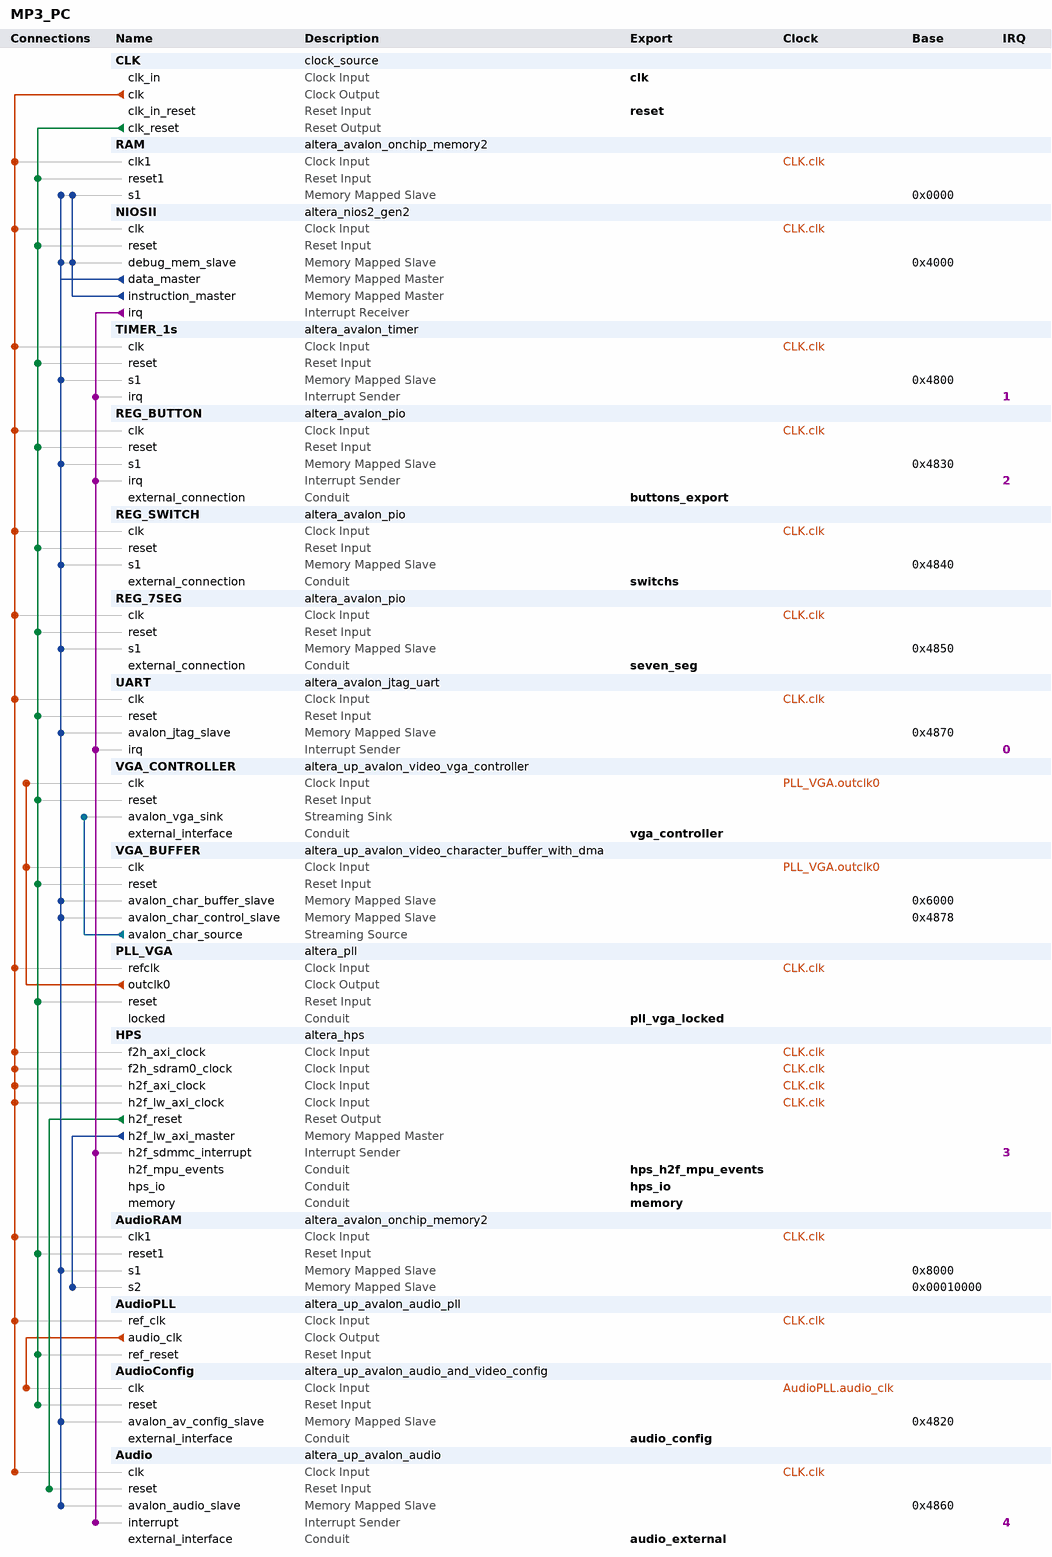
[diagram p0: system contents]
# Platform Designer (Qsys) system MP3_PC, Cyclone V 5CSEMA5F31C6
# Parameters at their usual value, and those the tool derives, are not listed.
package require -exact qsys 18.0
create_system MP3_PC
set_project_property DEVICE_FAMILY {Cyclone V}
set_project_property DEVICE 5CSEMA5F31C6

add_instance CLK clock_source 18.0
set_instance_parameter_value CLK clockFrequency 50000000

add_instance RAM altera_avalon_onchip_memory2 18.0
set_instance_parameter_value RAM dataWidth 32
set_instance_parameter_value RAM dualPort false
set_instance_parameter_value RAM initMemContent true
set_instance_parameter_value RAM initializationFileName onchip_mem.hex
set_instance_parameter_value RAM memorySize 16384
set_instance_parameter_value RAM singleClockOperation true

add_instance NIOSII altera_nios2_gen2 18.0
set_instance_parameter_value NIOSII dcache_size 2048
set_instance_parameter_value NIOSII exceptionSlave RAM.s1
set_instance_parameter_value NIOSII icache_size 4096
set_instance_parameter_value NIOSII impl Tiny
set_instance_parameter_value NIOSII resetSlave RAM.s1

add_instance TIMER_1s altera_avalon_timer 18.0
set_instance_parameter_value TIMER_1s fixedPeriod true
set_instance_parameter_value TIMER_1s period 1
set_instance_parameter_value TIMER_1s periodUnits MSEC

add_instance REG_BUTTON altera_avalon_pio 18.0
set_instance_parameter_value REG_BUTTON bitClearingEdgeCapReg true
set_instance_parameter_value REG_BUTTON captureEdge true
set_instance_parameter_value REG_BUTTON direction Input
set_instance_parameter_value REG_BUTTON edgeType FALLING
set_instance_parameter_value REG_BUTTON generateIRQ true
set_instance_parameter_value REG_BUTTON irqType EDGE
set_instance_parameter_value REG_BUTTON width 4

add_instance REG_SWITCH altera_avalon_pio 18.0
set_instance_parameter_value REG_SWITCH direction Input
set_instance_parameter_value REG_SWITCH width 3

add_instance REG_7SEG altera_avalon_pio 18.0
set_instance_parameter_value REG_7SEG direction Output
set_instance_parameter_value REG_7SEG width 28

add_instance UART altera_avalon_jtag_uart 18.0
set_instance_parameter_value UART simInteractiveOptions NO_INTERACTIVE_WINDOWS

add_instance VGA_CONTROLLER altera_up_avalon_video_vga_controller 18.0
set_instance_parameter_value VGA_CONTROLLER board DE1-SoC
set_instance_parameter_value VGA_CONTROLLER resolution {VGA 640x480}

add_instance VGA_BUFFER altera_up_avalon_video_character_buffer_with_dma 18.0
set_instance_parameter_value VGA_BUFFER enable_transparency false

add_instance PLL_VGA altera_pll 18.0
set_instance_parameter_value PLL_VGA gui_device_speed_grade 1
set_instance_parameter_value PLL_VGA gui_number_of_clocks 1
set_instance_parameter_value PLL_VGA gui_operation_mode direct
set_instance_parameter_value PLL_VGA gui_output_clock_frequency0 25.0
set_instance_parameter_value PLL_VGA gui_pll_mode {Integer-N PLL}
set_instance_parameter_value PLL_VGA gui_reference_clock_frequency 50.0
set_instance_parameter_value PLL_VGA gui_use_locked true

add_instance HPS altera_hps 18.0
set_instance_parameter_value HPS EMAC1_Mode N/A
set_instance_parameter_value HPS EMAC1_PinMuxing Unused
set_instance_parameter_value HPS F2SCLK_COLDRST_Enable false
set_instance_parameter_value HPS F2SCLK_DBGRST_Enable false
set_instance_parameter_value HPS F2SCLK_WARMRST_Enable false
set_instance_parameter_value HPS F2SDRAM_Type AXI-3
set_instance_parameter_value HPS F2SDRAM_Width 64
set_instance_parameter_value HPS F2SINTERRUPT_Enable false
set_instance_parameter_value HPS F2S_Width 2
set_instance_parameter_value HPS FPGA_PERIPHERAL_OUTPUT_CLOCK_FREQ_EMAC0_GTX_CLK 125
set_instance_parameter_value HPS FPGA_PERIPHERAL_OUTPUT_CLOCK_FREQ_EMAC0_MD_CLK 2.5
set_instance_parameter_value HPS FPGA_PERIPHERAL_OUTPUT_CLOCK_FREQ_EMAC1_GTX_CLK 125
set_instance_parameter_value HPS FPGA_PERIPHERAL_OUTPUT_CLOCK_FREQ_EMAC1_MD_CLK 2.5
set_instance_parameter_value HPS HPS_PROTOCOL DDR3
set_instance_parameter_value HPS I2C0_Mode N/A
set_instance_parameter_value HPS I2C0_PinMuxing Unused
set_instance_parameter_value HPS I2C1_Mode N/A
set_instance_parameter_value HPS I2C1_PinMuxing Unused
set_instance_parameter_value HPS LWH2F_Enable true
set_instance_parameter_value HPS MEM_BANKADDR_WIDTH 3
set_instance_parameter_value HPS MEM_CLK_FREQ 300.0
set_instance_parameter_value HPS MEM_CLK_FREQ_MAX 400.0
set_instance_parameter_value HPS MEM_COL_ADDR_WIDTH 8
set_instance_parameter_value HPS MEM_DQ_WIDTH 8
set_instance_parameter_value HPS MEM_DRV_STR RZQ/6
set_instance_parameter_value HPS MEM_ROW_ADDR_WIDTH 12
set_instance_parameter_value HPS MEM_RTT_NOM {ODT Disabled}
set_instance_parameter_value HPS MEM_RTT_WR {Dynamic ODT off}
set_instance_parameter_value HPS MEM_TCL 7
set_instance_parameter_value HPS MEM_TFAW_NS 37.5
set_instance_parameter_value HPS MEM_TINIT_US 499
set_instance_parameter_value HPS MEM_TMRD_CK 3
set_instance_parameter_value HPS MEM_TRAS_NS 40.0
set_instance_parameter_value HPS MEM_TRCD_NS 15.0
set_instance_parameter_value HPS MEM_TREFI_US 7.0
set_instance_parameter_value HPS MEM_TRFC_NS 75.0
set_instance_parameter_value HPS MEM_TRP_NS 15.0
set_instance_parameter_value HPS MEM_TWTR 2
set_instance_parameter_value HPS MEM_VENDOR JEDEC
set_instance_parameter_value HPS MEM_WTCL 6
set_instance_parameter_value HPS MPU_EVENTS_Enable true
set_instance_parameter_value HPS QSPI_Mode N/A
set_instance_parameter_value HPS QSPI_PinMuxing Unused
set_instance_parameter_value HPS REF_CLK_FREQ 125.0
set_instance_parameter_value HPS S2FCLK_USER2CLK 5
set_instance_parameter_value HPS S2FINTERRUPT_SDMMC_Enable true
set_instance_parameter_value HPS S2F_Width 2
set_instance_parameter_value HPS SDIO_Mode {4-bit Data}
set_instance_parameter_value HPS SDIO_PinMuxing {HPS I/O Set 0}
set_instance_parameter_value HPS SPIM1_Mode N/A
set_instance_parameter_value HPS SPIM1_PinMuxing Unused
set_instance_parameter_value HPS STM_Enable false
set_instance_parameter_value HPS TIMING_BOARD_AC_SKEW 0.02
set_instance_parameter_value HPS TIMING_BOARD_AC_TO_CK_SKEW 0.0
set_instance_parameter_value HPS TIMING_BOARD_DQ_TO_DQS_SKEW 0.0
set_instance_parameter_value HPS TIMING_BOARD_MAX_CK_DELAY 0.6
set_instance_parameter_value HPS TIMING_BOARD_MAX_DQS_DELAY 0.6
set_instance_parameter_value HPS TIMING_BOARD_SKEW_BETWEEN_DQS 0.02
set_instance_parameter_value HPS TIMING_BOARD_SKEW_CKDQS_DIMM_MAX 0.01
set_instance_parameter_value HPS TIMING_BOARD_SKEW_CKDQS_DIMM_MIN -0.01
set_instance_parameter_value HPS TIMING_BOARD_SKEW_WITHIN_DQS 0.02
set_instance_parameter_value HPS TIMING_TDH 125
set_instance_parameter_value HPS TIMING_TDQSCK 400
set_instance_parameter_value HPS TIMING_TDQSQ 120
set_instance_parameter_value HPS TIMING_TDS 50
set_instance_parameter_value HPS TIMING_TIH 250
set_instance_parameter_value HPS TIMING_TIS 175
set_instance_parameter_value HPS TIMING_TQSH 0.38
set_instance_parameter_value HPS UART0_Mode N/A
set_instance_parameter_value HPS UART0_PinMuxing Unused
set_instance_parameter_value HPS USB1_Mode N/A
set_instance_parameter_value HPS USB1_PinMuxing Unused
set_instance_parameter_value HPS desired_cfg_clk_mhz 100.0
set_instance_parameter_value HPS desired_qspi_clk_mhz 400.0

add_instance AudioRAM altera_avalon_onchip_memory2 18.0
set_instance_parameter_value AudioRAM dataWidth 8
set_instance_parameter_value AudioRAM dualPort true
set_instance_parameter_value AudioRAM initMemContent false
set_instance_parameter_value AudioRAM initializationFileName onchip_mem.hex
set_instance_parameter_value AudioRAM memorySize 32768
set_instance_parameter_value AudioRAM resetrequest_enabled false
set_instance_parameter_value AudioRAM singleClockOperation true

add_instance AudioPLL altera_up_avalon_audio_pll 18.0
set_instance_parameter_value AudioPLL gui_refclk 50.0

add_instance AudioConfig altera_up_avalon_audio_and_video_config 18.0
set_instance_parameter_value AudioConfig audio_in {Microphone to ADC}
set_instance_parameter_value AudioConfig bit_length 24
set_instance_parameter_value AudioConfig board DE1-SoC
set_instance_parameter_value AudioConfig line_in_bypass false
set_instance_parameter_value AudioConfig sampling_rate {48 kHz}

add_instance Audio altera_up_avalon_audio 18.0
set_instance_parameter_value Audio audio_in false
set_instance_parameter_value Audio avalon_bus_type {Memory Mapped}
set_instance_parameter_value Audio dw 16

# connections
add_connection AudioPLL.audio_clk AudioConfig.clk clock
add_connection CLK.clk Audio.clk clock
add_connection CLK.clk AudioPLL.ref_clk clock
add_connection CLK.clk AudioRAM.clk1 clock
add_connection CLK.clk HPS.f2h_axi_clock clock
add_connection CLK.clk HPS.f2h_sdram0_clock clock
add_connection CLK.clk HPS.h2f_axi_clock clock
add_connection CLK.clk HPS.h2f_lw_axi_clock clock
add_connection CLK.clk NIOSII.clk clock
add_connection CLK.clk PLL_VGA.refclk clock
add_connection CLK.clk RAM.clk1 clock
add_connection CLK.clk REG_7SEG.clk clock
add_connection CLK.clk REG_BUTTON.clk clock
add_connection CLK.clk REG_SWITCH.clk clock
add_connection CLK.clk TIMER_1s.clk clock
add_connection CLK.clk UART.clk clock
add_connection PLL_VGA.outclk0 VGA_BUFFER.clk clock
add_connection PLL_VGA.outclk0 VGA_CONTROLLER.clk clock
add_connection CLK.clk_reset AudioConfig.reset reset
add_connection CLK.clk_reset AudioPLL.ref_reset reset
add_connection CLK.clk_reset AudioRAM.reset1 reset
add_connection CLK.clk_reset NIOSII.reset reset
add_connection CLK.clk_reset PLL_VGA.reset reset
add_connection CLK.clk_reset RAM.reset1 reset
add_connection CLK.clk_reset REG_7SEG.reset reset
add_connection CLK.clk_reset REG_BUTTON.reset reset
add_connection CLK.clk_reset REG_SWITCH.reset reset
add_connection CLK.clk_reset TIMER_1s.reset reset
add_connection CLK.clk_reset UART.reset reset
add_connection CLK.clk_reset VGA_BUFFER.reset reset
add_connection CLK.clk_reset VGA_CONTROLLER.reset reset
add_connection HPS.h2f_reset Audio.reset reset
add_connection HPS.h2f_lw_axi_master AudioRAM.s2 avalon
set_connection_parameter_value HPS.h2f_lw_axi_master/AudioRAM.s2 baseAddress 0x00010000
add_connection NIOSII.data_master Audio.avalon_audio_slave avalon
set_connection_parameter_value NIOSII.data_master/Audio.avalon_audio_slave baseAddress 0x4860
add_connection NIOSII.data_master AudioConfig.avalon_av_config_slave avalon
set_connection_parameter_value NIOSII.data_master/AudioConfig.avalon_av_config_slave baseAddress 0x4820
add_connection NIOSII.data_master AudioRAM.s1 avalon
set_connection_parameter_value NIOSII.data_master/AudioRAM.s1 baseAddress 0x8000
add_connection NIOSII.data_master NIOSII.debug_mem_slave avalon
set_connection_parameter_value NIOSII.data_master/NIOSII.debug_mem_slave baseAddress 0x4000
add_connection NIOSII.data_master RAM.s1 avalon
set_connection_parameter_value NIOSII.data_master/RAM.s1 baseAddress 0x0000
add_connection NIOSII.data_master REG_7SEG.s1 avalon
set_connection_parameter_value NIOSII.data_master/REG_7SEG.s1 baseAddress 0x4850
add_connection NIOSII.data_master REG_BUTTON.s1 avalon
set_connection_parameter_value NIOSII.data_master/REG_BUTTON.s1 baseAddress 0x4830
add_connection NIOSII.data_master REG_SWITCH.s1 avalon
set_connection_parameter_value NIOSII.data_master/REG_SWITCH.s1 baseAddress 0x4840
add_connection NIOSII.data_master TIMER_1s.s1 avalon
set_connection_parameter_value NIOSII.data_master/TIMER_1s.s1 baseAddress 0x4800
add_connection NIOSII.data_master UART.avalon_jtag_slave avalon
set_connection_parameter_value NIOSII.data_master/UART.avalon_jtag_slave baseAddress 0x4870
add_connection NIOSII.data_master VGA_BUFFER.avalon_char_buffer_slave avalon
set_connection_parameter_value NIOSII.data_master/VGA_BUFFER.avalon_char_buffer_slave baseAddress 0x6000
add_connection NIOSII.data_master VGA_BUFFER.avalon_char_control_slave avalon
set_connection_parameter_value NIOSII.data_master/VGA_BUFFER.avalon_char_control_slave baseAddress 0x4878
add_connection NIOSII.instruction_master NIOSII.debug_mem_slave avalon
set_connection_parameter_value NIOSII.instruction_master/NIOSII.debug_mem_slave baseAddress 0x4000
add_connection NIOSII.instruction_master RAM.s1 avalon
set_connection_parameter_value NIOSII.instruction_master/RAM.s1 baseAddress 0x0000
add_connection VGA_BUFFER.avalon_char_source VGA_CONTROLLER.avalon_vga_sink avalon_streaming
add_connection NIOSII.irq Audio.interrupt interrupt
set_connection_parameter_value NIOSII.irq/Audio.interrupt irqNumber 4
add_connection NIOSII.irq HPS.h2f_sdmmc_interrupt interrupt
set_connection_parameter_value NIOSII.irq/HPS.h2f_sdmmc_interrupt irqNumber 3
add_connection NIOSII.irq REG_BUTTON.irq interrupt
set_connection_parameter_value NIOSII.irq/REG_BUTTON.irq irqNumber 2
add_connection NIOSII.irq TIMER_1s.irq interrupt
set_connection_parameter_value NIOSII.irq/TIMER_1s.irq irqNumber 1
add_connection NIOSII.irq UART.irq interrupt
set_connection_parameter_value NIOSII.irq/UART.irq irqNumber 0

# exported interfaces
add_interface audio_config conduit end
set_interface_property audio_config EXPORT_OF AudioConfig.external_interface
add_interface audio_external conduit end
set_interface_property audio_external EXPORT_OF Audio.external_interface
add_interface buttons_export conduit end
set_interface_property buttons_export EXPORT_OF REG_BUTTON.external_connection
add_interface clk clock sink
set_interface_property clk EXPORT_OF CLK.clk_in
add_interface hps_h2f_mpu_events conduit end
set_interface_property hps_h2f_mpu_events EXPORT_OF HPS.h2f_mpu_events
add_interface hps_io conduit end
set_interface_property hps_io EXPORT_OF HPS.hps_io
add_interface memory conduit end
set_interface_property memory EXPORT_OF HPS.memory
add_interface pll_vga_locked conduit end
set_interface_property pll_vga_locked EXPORT_OF PLL_VGA.locked
add_interface reset reset sink
set_interface_property reset EXPORT_OF CLK.clk_in_reset
add_interface seven_seg conduit end
set_interface_property seven_seg EXPORT_OF REG_7SEG.external_connection
add_interface switchs conduit end
set_interface_property switchs EXPORT_OF REG_SWITCH.external_connection
add_interface vga_controller conduit end
set_interface_property vga_controller EXPORT_OF VGA_CONTROLLER.external_interface

set_interconnect_requirement {$system} qsys_mm.clockCrossingAdapter HANDSHAKE
set_interconnect_requirement {$system} qsys_mm.enableEccProtection FALSE
set_interconnect_requirement {$system} qsys_mm.insertDefaultSlave FALSE
set_interconnect_requirement {$system} qsys_mm.maxAdditionalLatency 1

save_system MP3_PC.qsys
